# Altium schematic sheet Logic.schdoc
size A; SheetNumber: 3; SheetTotal: 5
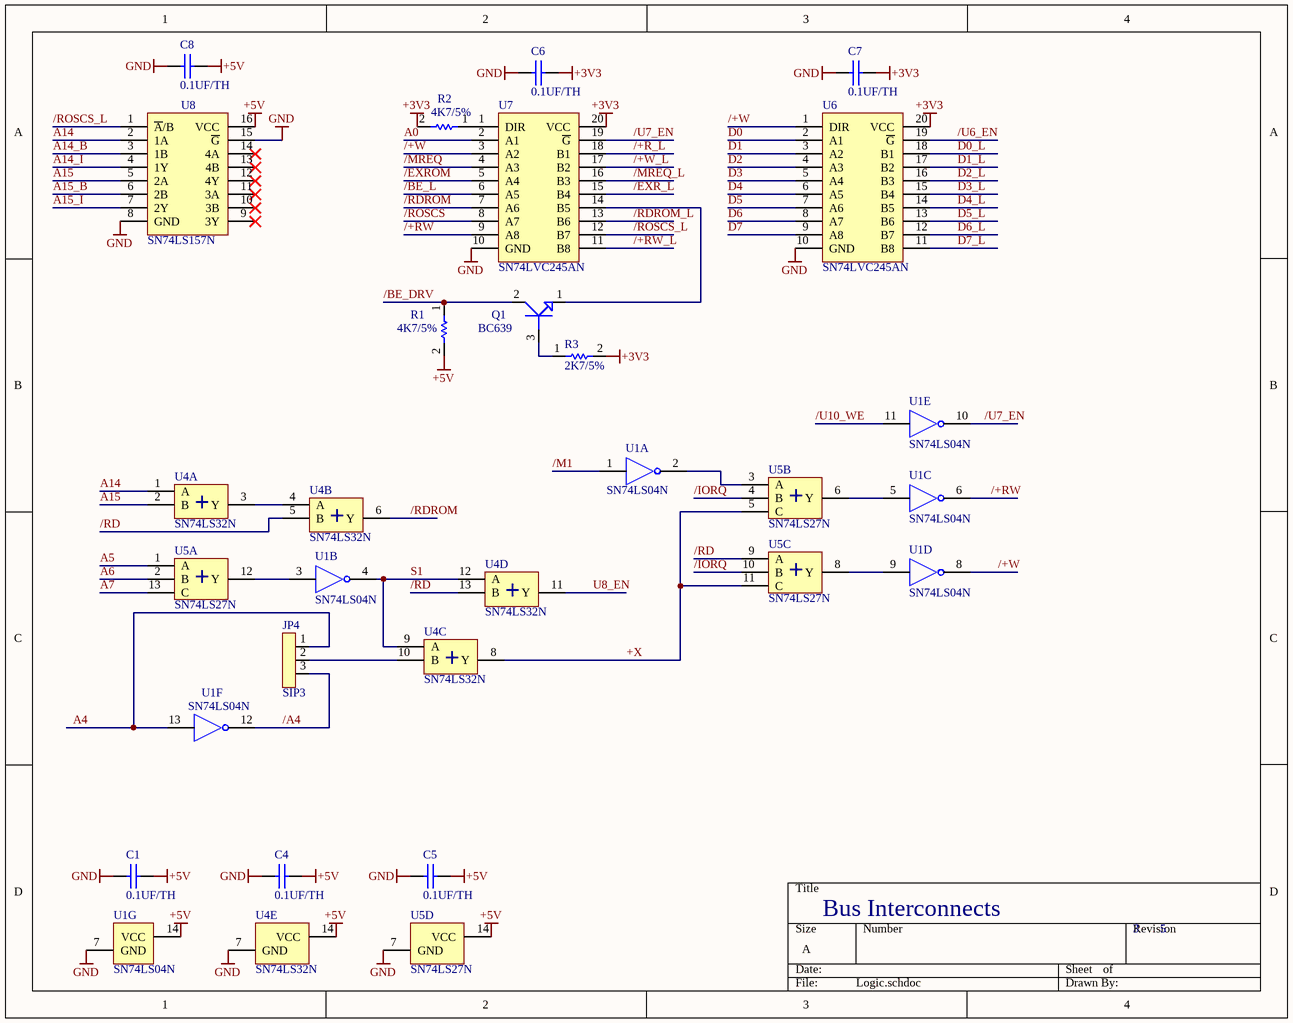
[diagram p0: Logic.schdoc]

## Parts
C1  0.1UF/TH  [CAPH5]
C4  0.1UF/TH  [CAPH5]
C5  0.1UF/TH  [CAPH5]
C6  0.1UF/TH  [CAPH5]
C7  0.1UF/TH  [CAPH5]
C8  0.1UF/TH  [CAPH5]
JP4  SIP3  [SIP3]
Q1  BC639  [TO92]
R1  4K7/5%  [CF18]
R2  4K7/5%  [CF18]
R3  2K7/5%  [CF18]
U1  SN74LS04N  [dip14]  (parts A,B,C,D,E,F,G of 7)
U4  SN74LS32N  [dip14]  (parts A,B,C,D,E of 5)
U5  SN74LS27N  [dip14]  (parts A,B,C,D of 4)
U6  SN74LVC245AN  [DIP20]
U7  SN74LVC245AN  [DIP20]
U8  SN74LS157N  [DIP16]

## Nets
+3V3: C6.2 C7.2 R2.2 R3.2 U6.20(VCC) U7.20(VCC)
+5V: C1.2 C4.2 C5.2 C8.2 R1.2 U1.14(VCC) U4.14(VCC) U5.14(VCC) U8.16(VCC)
GND: C1.1 C4.1 C5.1 C6.1 C7.1 C8.1 U1.7(GND) U4.7(GND) U5.7(GND) U6.10(GND) U7.10(GND) U8.8(GND) U8.15(~{G})
+X: U4.8(Y) U5.5(C) U5.11(C)
/+R_L: U7.18(B1)
/+RW: U1.6 U7.9(A8)
/+RW_L: U7.11(B8)
/+W: U1.8 U6.1(DIR) U7.3(A2)
/+W_L: U7.17(B2)
/A4: JP4.3 U1.12
/BE_DRV: Q1.2(COLLECTOR) R1.1
/BE_L: U7.6(A5)
/EXR_L: U7.15(B4)
/EXROM: U7.5(A4)
/IORQ: U5.4(B) U5.10(B)
/M1: U1.1
/MREQ: U7.4(A3)
/MREQ_L: U7.16(B3)
/RD: U4.5(B) U4.13(B) U5.9(A)
/RDROM: U4.6(Y) U7.7(A6)
/RDROM_L: U7.13(B6)
/ROSCS: U7.8(A7)
/ROSCS_L: U7.12(B7) U8.1(~{A}/B)
/U6_EN: U6.19(~{G})
/U7_EN: U1.10 U7.19(~{G})
/U10_WE: U1.11
A0: U7.2(A1)
A4: JP4.1 U1.13
A5: U5.1(A)
A6: U5.2(B)
A7: U5.13(C)
A14: U4.1(A) U8.2(1A)
A14_B: U8.3(1B)
A14_I: U8.4(1Y)
A15: U4.2(B) U8.5(2A)
A15_B: U8.6(2B)
A15_I: U8.7(2Y)
D0: U6.2(A1)
D0_L: U6.18(B1)
D1: U6.3(A2)
D1_L: U6.17(B2)
D2: U6.4(A3)
D2_L: U6.16(B3)
D3: U6.5(A4)
D3_L: U6.15(B4)
D4: U6.6(A5)
D4_L: U6.14(B5)
D5: U6.7(A6)
D5_L: U6.13(B6)
D6: U6.8(A7)
D6_L: U6.12(B7)
D7: U6.9(A8)
D7_L: U6.11(B8)
S1: U1.4 U4.9(A) U4.12(A)
U8_EN: U4.11(Y)
NetJP4_2: JP4.2 U4.10(B)
NetQ1_1: Q1.1(EMITTER) U7.14(B5)
NetQ1_3: Q1.3(BASE) R3.1
NetR2_1: R2.1 U7.1(DIR)
NetU1_2: U1.2 U5.3(A)
NetU1_3: U1.3 U5.12(Y)
NetU1_5: U1.5 U5.6(Y)
NetU1_9: U1.9 U5.8(Y)
NetU4_3: U4.3(Y) U4.4(A)

Not connected (* = marked no-connect by the designer): U8 9(3Y)* 10(3B)* 11(3A)* 12(4Y)* 13(4B)* 14(4A)*

## Notes on the sheet
- Bus Interconnects
- (in symbol SN74LS27N, part A) +
- (in symbol SN74LS27N, part B) +
- (in symbol SN74LS27N, part C) +
- (in symbol SN74LS32N, part A) +
- (in symbol SN74LS32N, part B) +
- (in symbol SN74LS32N, part C) +
- (in symbol SN74LS32N, part D) +

## Library data of the parts
C1 C4-C8 = 0.1UF/TH: 0.1 µF ±10% 50V Ceramic Capacitor X7R Radial; MFG: Vishay; MFG PN: K104K10X7RF5UH5; DK PN: BC2665CT-ND; Price: 1.17
Q1 = BC639: Bipolar (BJT) Transistor NPN 80 V 1 A 200MHz 625 mW Through Hole TO-92 (TO-226); MFG: Infineon; MFG PN: BC639; Price: 0.58000
R1 R2 = 4K7/5%: RES 4.7K OHM 5% 1/8W AXIAL; MFG PN: CF18JT4K70; DK PN: CF18JT4K70CT-ND; MFG: Stackpole; Populate: *
R3 = 2K7/5%: RES 2.7K OHM 5% 1/8W AXIAL; MFG PN: CF18JT2K70; DK PN: CF18JT2K70CT-ND; MFG: Stackpole; FOOTPRINT: RNF14; Populate: *
U1 = SN74LS04N: Inverter IC 6 Channel 14-PDIP; MFG: TI; DK PN: 296-1629-5-ND; MFG PN: SN74LS04N; Price: 1.17
U4 = SN74LS32N: IC GATE OR 4CH 2-INP 14DIP; MFG: TI; DK PN: 296-1658-5-ND; MFG PN: SN74LS32N; Price: 1.17
U5 = SN74LS27N: NOR Gate IC 3 Channel 14-PDIP; MFG: TI; DK PN: 296-14890-5-ND; MFG PN: SN74LS27N; Price: 1.17
U6 U7 = SN74LVC245AN: Transceiver, Non-Inverting 1 Element 8 Bit per Element 3-State Output 20-PDIP; MFG: TI; DK PN: 296-8503-5-ND; MFG PN: SN74LVC245AN; Price: 1.17
U8 = SN74LS157N: IC MULTIPLEXER 4 X 2:1 16DIP; MFG: TI; DK PN: 296-1645-5-ND; MFG PN: SN74LS157N; Price: 1.17